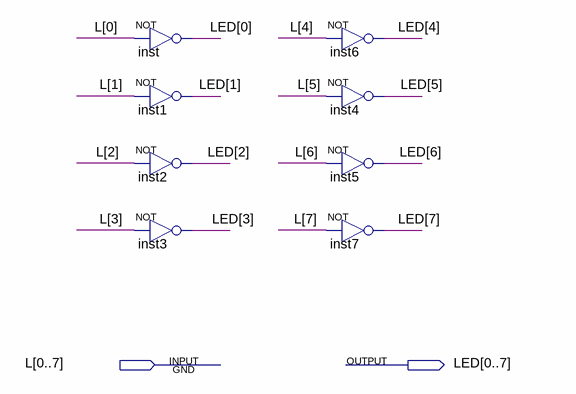
[diagram p0: schematic sheet]
// Quartus schematic LEDpro.bdf as structural Verilog: 8 symbols, 2 pins
module LEDpro (
  input  [0:7] L,
  output [0:7] LED
);

  not inst (LED[0], L[0]);
  not inst1 (LED[1], L[1]);
  not inst2 (LED[2], L[2]);
  not inst3 (LED[3], L[3]);
  not inst6 (LED[4], L[4]);
  not inst4 (LED[5], L[5]);
  not inst5 (LED[6], L[6]);
  not inst7 (LED[7], L[7]);
endmodule
